# EAGLE schematic Poloneiraol (EAGLE 9.1.3)
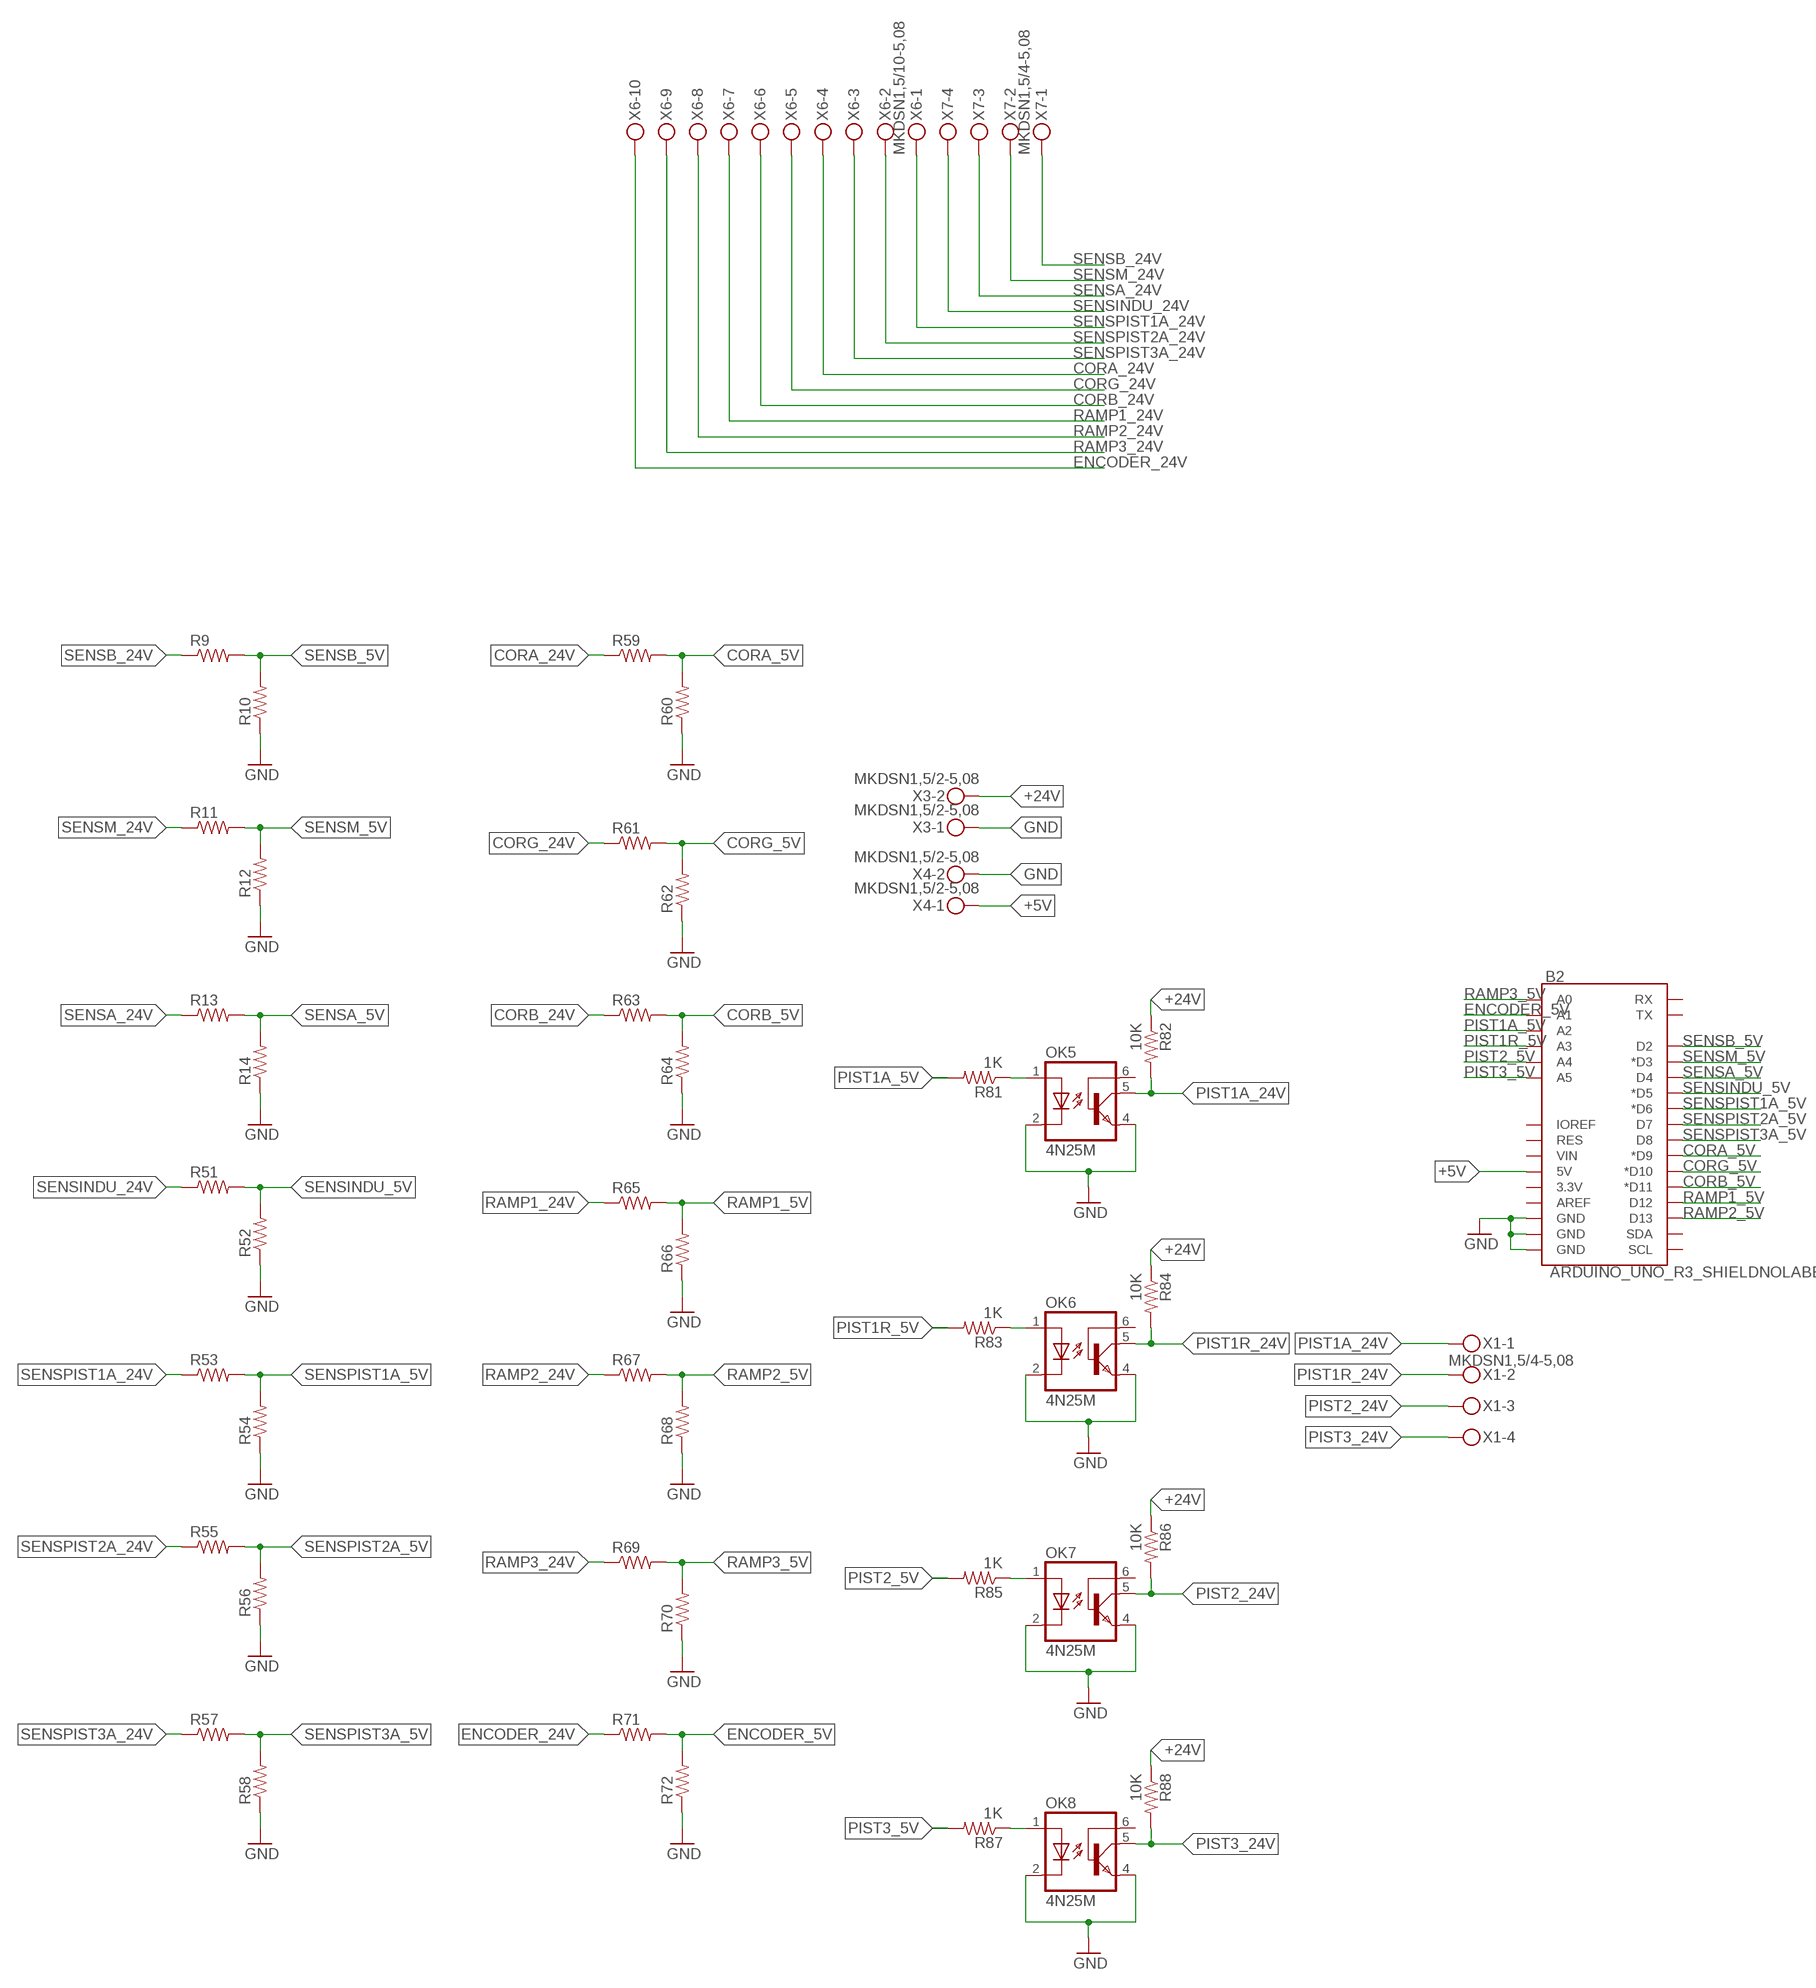
[diagram p0: schematic, sheet 1]

## Parts
B2  ARDUINO_UNO_R3_SHIELDNOLABELS  [UNO_R3_SHIELD_NOLABELS]
OK5  4N25M  [DIL06]
OK6  4N25M  [DIL06]
OK7  4N25M  [DIL06]
OK8  4N25M  [DIL06]
R9  RESISTORAXIAL-0.3  [AXIAL-0.3]
R10  RESISTORAXIAL-0.3  [AXIAL-0.3]
R11  RESISTORAXIAL-0.3  [AXIAL-0.3]
R12  RESISTORAXIAL-0.3  [AXIAL-0.3]
R13  RESISTORAXIAL-0.3  [AXIAL-0.3]
R14  RESISTORAXIAL-0.3  [AXIAL-0.3]
R51  RESISTORAXIAL-0.3  [AXIAL-0.3]
R52  RESISTORAXIAL-0.3  [AXIAL-0.3]
R53  RESISTORAXIAL-0.3  [AXIAL-0.3]
R54  RESISTORAXIAL-0.3  [AXIAL-0.3]
R55  RESISTORAXIAL-0.3  [AXIAL-0.3]
R56  RESISTORAXIAL-0.3  [AXIAL-0.3]
R57  RESISTORAXIAL-0.3  [AXIAL-0.3]
R58  RESISTORAXIAL-0.3  [AXIAL-0.3]
R59  RESISTORAXIAL-0.3  [AXIAL-0.3]
R60  RESISTORAXIAL-0.3  [AXIAL-0.3]
R61  RESISTORAXIAL-0.3  [AXIAL-0.3]
R62  RESISTORAXIAL-0.3  [AXIAL-0.3]
R63  RESISTORAXIAL-0.3  [AXIAL-0.3]
R64  RESISTORAXIAL-0.3  [AXIAL-0.3]
R65  RESISTORAXIAL-0.3  [AXIAL-0.3]
R66  RESISTORAXIAL-0.3  [AXIAL-0.3]
R67  RESISTORAXIAL-0.3  [AXIAL-0.3]
R68  RESISTORAXIAL-0.3  [AXIAL-0.3]
R69  RESISTORAXIAL-0.3  [AXIAL-0.3]
R70  RESISTORAXIAL-0.3  [AXIAL-0.3]
R71  RESISTORAXIAL-0.3  [AXIAL-0.3]
R72  RESISTORAXIAL-0.3  [AXIAL-0.3]
R81  1K  1KOHM-1/4W-1%(PTH)HORIZ-KIT  [AXIAL-0.3EZ]
R82  10K  1KOHM-1/4W-1%(PTH)HORIZ-KIT  [AXIAL-0.3EZ]
R83  1K  1KOHM-1/4W-1%(PTH)HORIZ-KIT  [AXIAL-0.3EZ]
R84  10K  1KOHM-1/4W-1%(PTH)HORIZ-KIT  [AXIAL-0.3EZ]
R85  1K  1KOHM-1/4W-1%(PTH)HORIZ-KIT  [AXIAL-0.3EZ]
R86  10K  RESISTORAXIAL-0.3  [AXIAL-0.3]
R87  1K  1KOHM-1/4W-1%(PTH)HORIZ-KIT  [AXIAL-0.3EZ]
R88  10K  1KOHM-1/4W-1%(PTH)HORIZ-KIT  [AXIAL-0.3EZ]
X1  MKDSN1,5/4-5,08  [MKDSN1,5/4-5,08]
X3  MKDSN1,5/2-5,08  [MKDSN1,5/2-5,08]
X4  MKDSN1,5/2-5,08  [MKDSN1,5/2-5,08]
X6  MKDSN1,5/10-5,08  [MKDSN1,5/10-5,08]
X7  MKDSN1,5/4-5,08  [MKDSN1,5/4-5,08]

## Nets
+5V: B2.5V X4.1
+24V: R82.P$1 R84.P$1 R86.P$1 R88.P$1 X3.2
CORA_5V: B2.D9(*D9) R59.P$2 R60.P$2
CORA_24V: R59.P$1 X6.4
CORB_5V: B2.D11(*D11) R63.P$2 R64.P$2
CORB_24V: R63.P$1 X6.6
CORG_5V: B2.D10(*D10) R61.P$2 R62.P$2
CORG_24V: R61.P$1 X6.5
ENCODER_5V: B2.A1 R71.P$2 R72.P$2
ENCODER_24V: R71.P$1 X6.10
GND: B2.GND@0(GND) B2.GND@1(GND) B2.GND@2(GND) OK5.2(C) OK5.4(EMI) OK6.2(C) OK6.4(EMI) OK7.2(C) OK7.4(EMI) OK8.2(C) OK8.4(EMI) R10.P$1 R12.P$1 R14.P$1 R52.P$1 R54.P$1 R56.P$1 R58.P$1 R60.P$1 R62.P$1 R64.P$1 R66.P$1 R68.P$1 R70.P$1 R72.P$1 X3.1 X4.2
N$4: OK5.1(A) R81.P$1
N$5: OK6.1(A) R83.P$1
N$6: OK7.1(A) R85.P$1
N$7: OK8.1(A) R87.P$1
PIST1A_5V: B2.A2 R81.P$2
PIST1A_24V: OK5.5(COL) R82.P$2 X1.1
PIST1R_5V: B2.A3 R83.P$2
PIST1R_24V: OK6.5(COL) R84.P$2 X1.2
PIST2_5V: B2.A4 R85.P$2
PIST2_24V: OK7.5(COL) R86.P$2 X1.3
PIST3_5V: B2.A5 R87.P$2
PIST3_24V: OK8.5(COL) R88.P$2 X1.4
RAMP1_5V: B2.D12 R65.P$2 R66.P$2
RAMP1_24V: R65.P$1 X6.7
RAMP2_5V: B2.D13 R67.P$2 R68.P$2
RAMP2_24V: R67.P$1 X6.8
RAMP3_5V: B2.A0 R69.P$2 R70.P$2
RAMP3_24V: R69.P$1 X6.9
SENSA_5V: B2.D4 R13.P$2 R14.P$2
SENSA_24V: R13.P$1 X7.3
SENSB_5V: B2.D2 R9.P$2 R10.P$2
SENSB_24V: R9.P$1 X7.1
SENSINDU_5V: B2.D5(*D5) R51.P$2 R52.P$2
SENSINDU_24V: R51.P$1 X7.4
SENSM_5V: B2.D3(*D3) R11.P$2 R12.P$2
SENSM_24V: R11.P$1 X7.2
SENSPIST1A_5V: B2.D6(*D6) R53.P$2 R54.P$2
SENSPIST1A_24V: R53.P$1 X6.1
SENSPIST2A_5V: B2.D7 R55.P$2 R56.P$2
SENSPIST2A_24V: R55.P$1 X6.2
SENSPIST3A_5V: B2.D8 R57.P$2 R58.P$2
SENSPIST3A_24V: R57.P$1 X6.3
Unconnected: B2.3.3V B2.AREF B2.IOREF B2.RES B2.RX B2.SCL B2.SDA B2.TX B2.VIN OK5.6(BAS) OK6.6(BAS) OK7.6(BAS) OK8.6(BAS)

## Library data of the parts
B2 = SparkFun-Boards:ARDUINO_UNO_R3_SHIELD: Arduino R3 Shield Footprint Shield form compatible with the Arduino Uno R3. SparkFun Products: MG2639 Cellular Shield <https://www.sparkfun.com/products/13120> MIDI Shield <https://www.sparkfun.com/products/12898> R3 Stackable Headers Kit <https://www.sparkfun.com/products/11417>
OK5-OK8 = optocoupler:4N*?M: General Purpose 6-Pin Phototransistor Optocouplers Source: http://www.fairchildsemi.com/ds/4N/4N35-M.pdf; MPN: 4N25-M; OC_FARNELL: 1021349; OC_NEWARK: 98K9084
R9-R14 R51-R72 R86 = SparkFun-Resistors:RESISTOR: Resistor Basic schematic elements and footprints for 0603, 1206, and PTH resistors.
R81 R83 R85 R87 = SparkFun-Resistors:1KOHM-1/4W-1%(PTH): RES-12182; PROD_ID: RES-12182
R82 R84 R88 = SparkFun-Resistors:1KOHM-1/4W-1%(PTH): RES-12182; PROD_ID: RES-12182; VALUE: 1K
X1 X7 = con-phoenix-508:MKDSN1,5/4-5,08: MKDSN 1,5/ 4-5,08 Printklemme Nennstrom: 13,5 A Nennspannung: 250 V Rastermaß: 5,08 mm Polzahl: 4 Anschlussart: Schraubanschluss Montage: Löten Anschlussrichtung Leiter/Platine: 0 ° Artikelnummer: 1729144 Source: http://eshop.phoenixcontact.com .. 1729144.pdf
X3 X4 = con-phoenix-508:MKDSN1,5/2-5,08: MKDSN 1,5/ 2-5,08 Printklemme Nennstrom: 13,5 A Nennspannung: 250 V Rastermaß: 5,08 mm Polzahl: 2 Anschlussart: Schraubanschluss Montage: Löten Anschlussrichtung Leiter/Platine: 0 ° Artikelnummer: 1729128 Source: http://eshop.phoenixcontact.com .. 1729128.pdf
X6 = con-phoenix-508:MKDSN1,5/10-5,08: MKDSN 1,5/10-5,08 Printklemme Nennstrom: 13,5 A Nennspannung: 250 V Rastermaß: 5,08 mm Polzahl: 10 Anschlussart: Schraubanschluss Montage: Löten Anschlussrichtung Leiter/Platine: 0 ° Artikelnummer: 1729209 Source: http://eshop.phoenixcontact.com .. 1729209.pdf